# Altium schematic sheet FEV-60_Motor_Driver.SchDoc
size B; Revision: A0
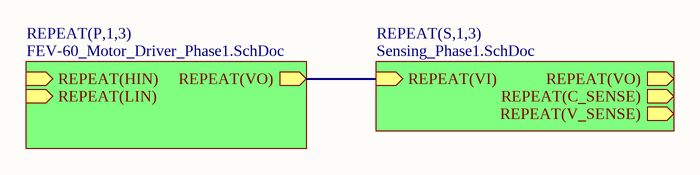
[diagram p0: FEV-60_Motor_Driver.SchDoc]

## Sub-sheets
REPEAT(P,1,3) = FEV-60_Motor_Driver_Phase1.SchDoc: REPEAT(HIN) (in), REPEAT(LIN) (in), REPEAT(VO) (out)
REPEAT(S,1,3) = Sensing_Phase1.SchDoc: REPEAT(VI) (in), REPEAT(VO) (out), REPEAT(C_SENSE) (out), REPEAT(V_SENSE) (out)

## Nets
(unnamed): sheet REPEAT(P,1,3)/REPEAT(VO), sheet REPEAT(S,1,3)/REPEAT(VI)

## Notes on the sheet
- Title
- Date:
- Revision:
- Number:
- Team Skytanic
- Sheet
- of
- Senior Design
- 2019/2020
- File: